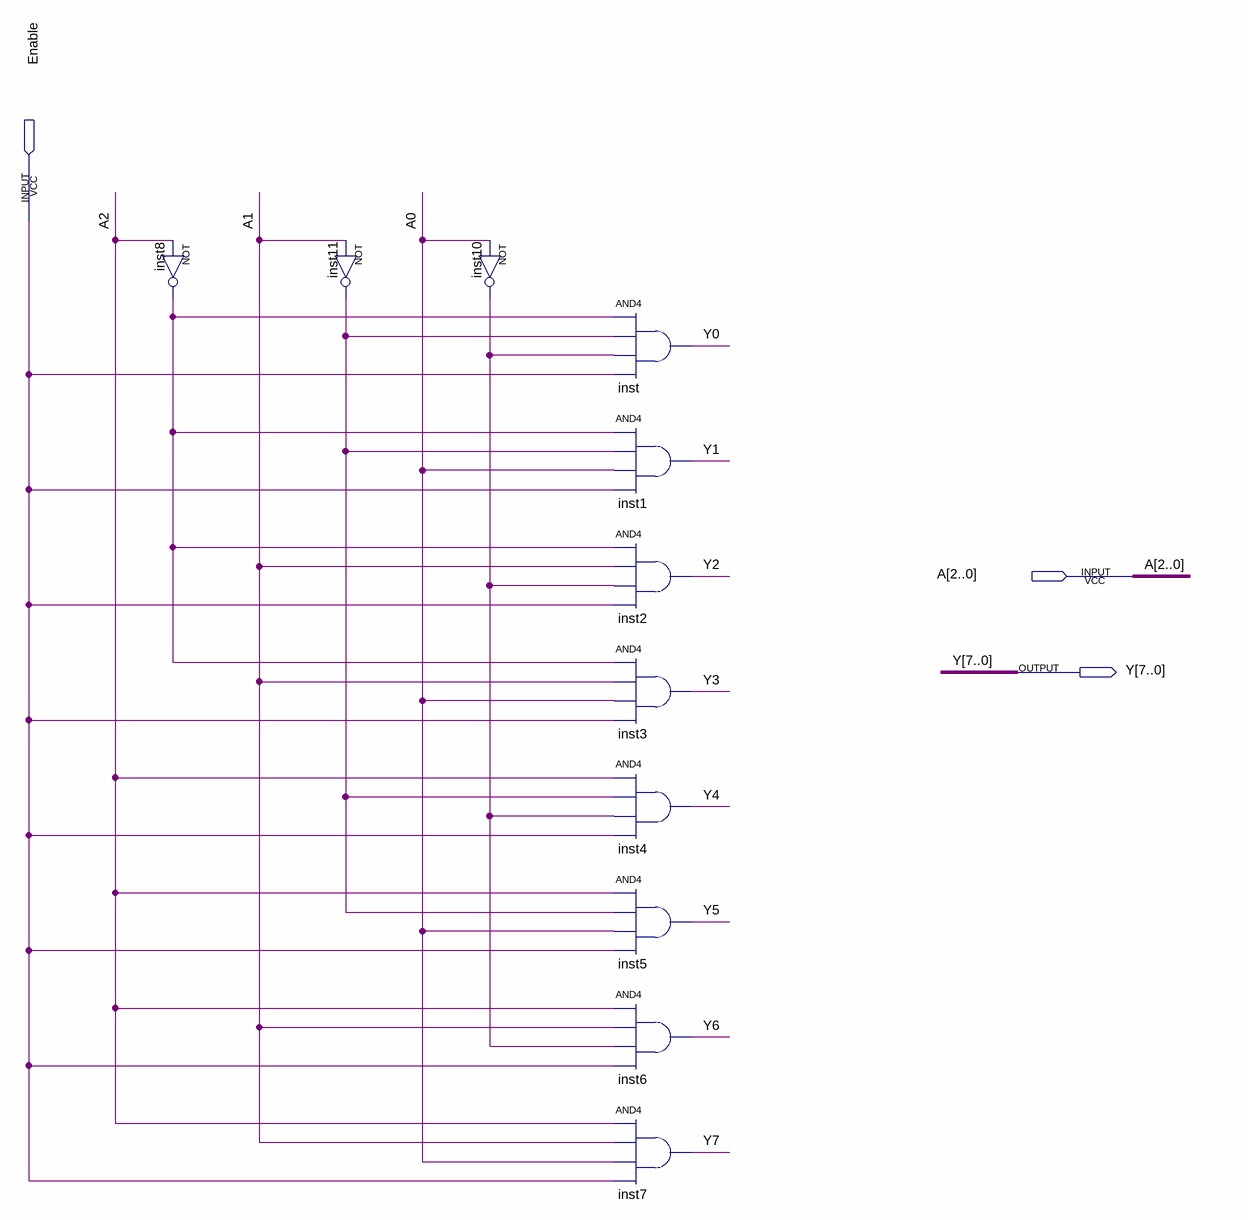
[diagram p0: schematic sheet]
// Quartus schematic decoder3to8.bdf as structural Verilog: 11 symbols, 3 pins
module decoder3to8 (
  input  Enable,
  input  [2:0] A,
  output [7:0] Y
);

  wire inst8_out, inst10_out, inst11_out;

  not inst8 (inst8_out, A[2]);
  not inst11 (inst11_out, A[1]);
  not inst10 (inst10_out, A[0]);
  and inst (Y[0], inst8_out, inst11_out, inst10_out, Enable);
  and inst1 (Y[1], inst8_out, inst11_out, A[0], Enable);
  and inst2 (Y[2], inst8_out, A[1], inst10_out, Enable);
  and inst3 (Y[3], inst8_out, A[1], A[0], Enable);
  and inst4 (Y[4], A[2], inst11_out, inst10_out, Enable);
  and inst5 (Y[5], A[2], inst11_out, A[0], Enable);
  and inst6 (Y[6], A[2], A[1], inst10_out, Enable);
  and inst7 (Y[7], A[2], A[1], A[0], Enable);
endmodule
